# EAGLE design Wifi Board (EAGLE 9.4.2)
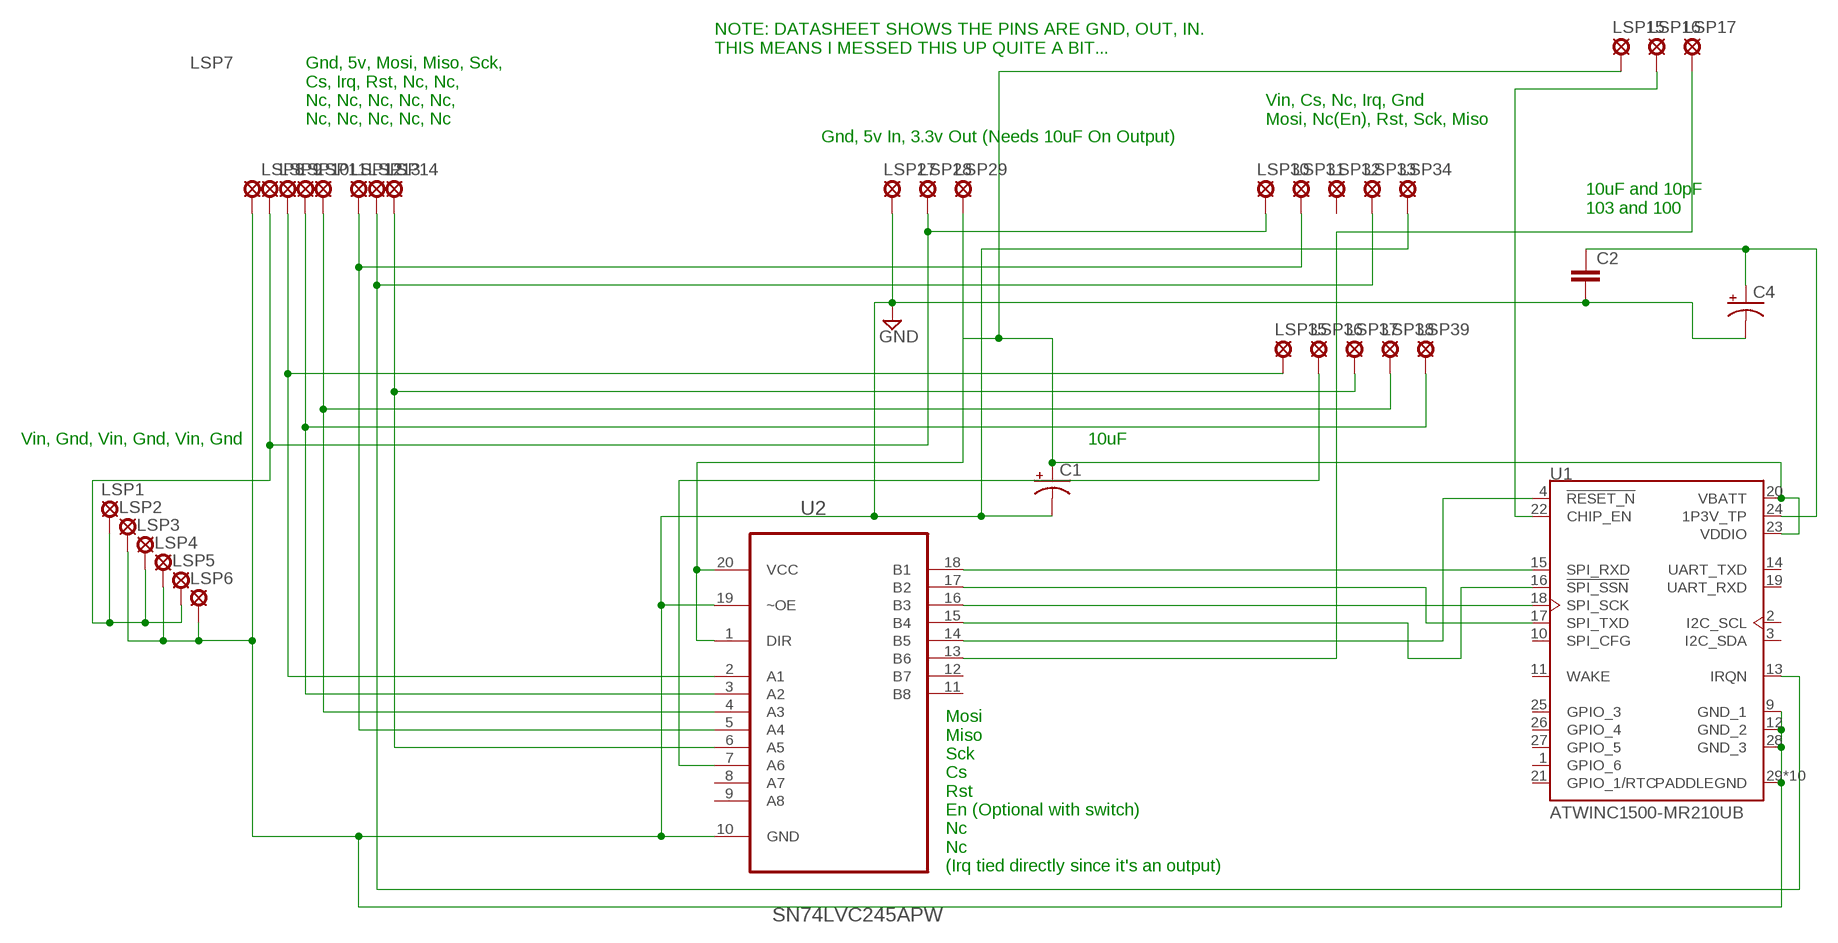
[diagram p0: schematic, sheet 1]

## Parts
C1  CPOL-USE2-4  [E2-4]
C2  C5/2.5  [C5B2.5]
C4  CPOL-USE2-4  [E2-4]
LSP1  LSP10_CLSP10_C  [LSP10_C]
LSP2  LSP10_CLSP10_C  [LSP10_C]
LSP3  LSP10_CLSP10_C  [LSP10_C]
LSP4  LSP10_CLSP10_C  [LSP10_C]
LSP5  LSP10_CLSP10_C  [LSP10_C]
LSP6  LSP10_CLSP10_C  [LSP10_C]
LSP7  LSP10_CLSP10_C  [LSP10_C]
LSP8  LSP10_CLSP10_C  [LSP10_C]
LSP9  LSP10_CLSP10_C  [LSP10_C]
LSP10  LSP10_CLSP10_C  [LSP10_C]
LSP11  LSP10_CLSP10_C  [LSP10_C]
LSP12  LSP10_CLSP10_C  [LSP10_C]
LSP13  LSP10_CLSP10_C  [LSP10_C]
LSP14  LSP10_CLSP10_C  [LSP10_C]
LSP15  LSP10_CLSP10_C  [LSP10_C]
LSP16  LSP10_CLSP10_C  [LSP10_C]
LSP17  LSP10_CLSP10_C  [LSP10_C]
LSP27  LSP10_CLSP10_C  [LSP10_C]
LSP28  LSP10_CLSP10_C  [LSP10_C]
LSP29  LSP10_CLSP10_C  [LSP10_C]
LSP30  LSP10_CLSP10_C  [LSP10_C]
LSP31  LSP10_CLSP10_C  [LSP10_C]
LSP32  LSP10_CLSP10_C  [LSP10_C]
LSP33  LSP10_CLSP10_C  [LSP10_C]
LSP34  LSP10_CLSP10_C  [LSP10_C]
LSP35  LSP10_CLSP10_C  [LSP10_C]
LSP36  LSP10_CLSP10_C  [LSP10_C]
LSP37  LSP10_CLSP10_C  [LSP10_C]
LSP38  LSP10_CLSP10_C  [LSP10_C]
LSP39  LSP10_CLSP10_C  [LSP10_C]
U1  ATWINC1500-MR210UB  [MICROCHIP_ATWINC1500-MR210UB]
U2  SN74LVC245APW  [SOP65P640X120-20N]

## Nets
GND: C1.- C2.2 C4.- LSP2.P$1(MP) LSP4.P$1(MP) LSP6.P$1(MP) LSP7.P$1(MP) LSP27.P$1(MP) LSP34.P$1(MP) U1.9(GND_1) U1.12(GND_2) U1.28(GND_3) U1.29(PADDLEGND) U1.P$1(PADDLEGND) U1.P$2(PADDLEGND) U1.P$3(PADDLEGND) U1.P$4(PADDLEGND) U1.P$5(PADDLEGND) U1.P$6(PADDLEGND) U1.P$7(PADDLEGND) U1.P$8(PADDLEGND) U1.P$9(PADDLEGND) U2.10(GND) U2.19(~OE)
N$1: LSP36.P$1(MP) U2.7(A6)
N$2: LSP1.P$1(MP) LSP3.P$1(MP) LSP5.P$1(MP) LSP8.P$1(MP) LSP28.P$1(MP) LSP30.P$1(MP)
N$4: C1.+ LSP15.P$1(MP) LSP29.P$1(MP) U1.20(VBATT) U1.23(VDDIO) U2.1(DIR) U2.20(VCC)
N$5: LSP9.P$1(MP) LSP35.P$1(MP) U2.2(A1)
N$6: LSP10.P$1(MP) LSP39.P$1(MP) U2.3(A2)
N$7: LSP11.P$1(MP) LSP38.P$1(MP) U2.4(A3)
N$8: LSP12.P$1(MP) LSP31.P$1(MP) U2.5(A4)
N$9: LSP13.P$1(MP) LSP33.P$1(MP) U1.13(IRQN)
N$10: LSP14.P$1(MP) LSP37.P$1(MP) U2.6(A5)
N$11: U1.15(SPI_RXD) U2.18(B1)
N$12: U1.17(SPI_TXD) U2.17(B2)
N$13: U1.18(SPI_SCK) U2.16(B3)
N$14: U1.16(!SPI_SSN) U2.15(B4)
N$15: LSP17.P$1(MP) U2.13(B6)
N$16: U1.4(!RESET_N) U2.14(B5)
N$17: LSP16.P$1(MP) U1.22(CHIP_EN)
N$20: C2.1 C4.+ U1.24(1P3V_TP)
Unconnected: LSP32.P$1(MP) U1.1(GPIO_6) U1.2(I2C_SCL) U1.3(I2C_SDA) U1.10(SPI_CFG) U1.11(WAKE) U1.14(UART_TXD) U1.19(UART_RXD) U1.21(GPIO_1/RTC) U1.25(GPIO_3) U1.26(GPIO_4) U1.27(GPIO_5) U2.8(A7) U2.9(A8) U2.11(B8) U2.12(B7)

## Notes on the sheet
- NOTE: DATASHEET SHOWS THE PINS ARE GND, OUT, IN.
  THIS MEANS I MESSED THIS UP QUITE A BIT...
- Gnd, 5v, Mosi, Miso, Sck,
  Cs, Irq, Rst, Nc, Nc,
  Nc, Nc, Nc, Nc, Nc,
  Nc, Nc, Nc, Nc, Nc
- Vin, Cs, Nc, Irq, Gnd
  Mosi, Nc(En), Rst, Sck, Miso
- Gnd, 5v In, 3.3v Out (Needs 10uF On Output)
- 10uF and 10pF
  103 and 100
- Vin, Gnd, Vin, Gnd, Vin, Gnd | 10uF
- Mosi
  Miso
  Sck
  Cs
  Rst
  En (Optional with switch)
  Nc
  Nc
  (Irq tied directly since it's an output)

## Library data of the parts
C1 C4 = rcl:CPOL-US: POLARIZED CAPACITOR, American symbol; SPICEPREFIX: C
C2 = capacitor-wima:C: CAPACITOR naming: grid - package width
LSP1-LSP17 LSP27-LSP39 = tbtaco-solpad:LSP10_C: SOLDER PAD drill 1.0 mm, distributor Buerklin, 12H555
U1 = ATWINC1500-MR210UB:ATWINC1500-MR210UB: SmartConnect ATWINC1500B-MU-T Module - SmartConnect ATWINC1500B-MU-T Module/ MODULE (R3); AVAILABILITY: Unavailable; DESCRIPTION: SmartConnect ATWINC1500B-MU-T Module - SmartConnect ATWINC1500B-MU-T Module/ MODULE _R3_; MF: Microchip; MP: ATWINC1500-MR210UB; PACKAGE: Module Microchip; PRICE: None
U2 = SN74LVC245APW:SN74LVC245APW: OCTAL BUS TRANSCEIVER WITH 3-STATE OUTPUTS; AVAILABILITY: Unavailable; DESCRIPTION: Octal Bus Transceiver With 3-State Outputs 20-TSSOP -40 to 125; MF: Texas Instruments; MP: SN74LVC245APW; PACKAGE: TSSOP-20 Texas Instruments; PRICE: None

## Board
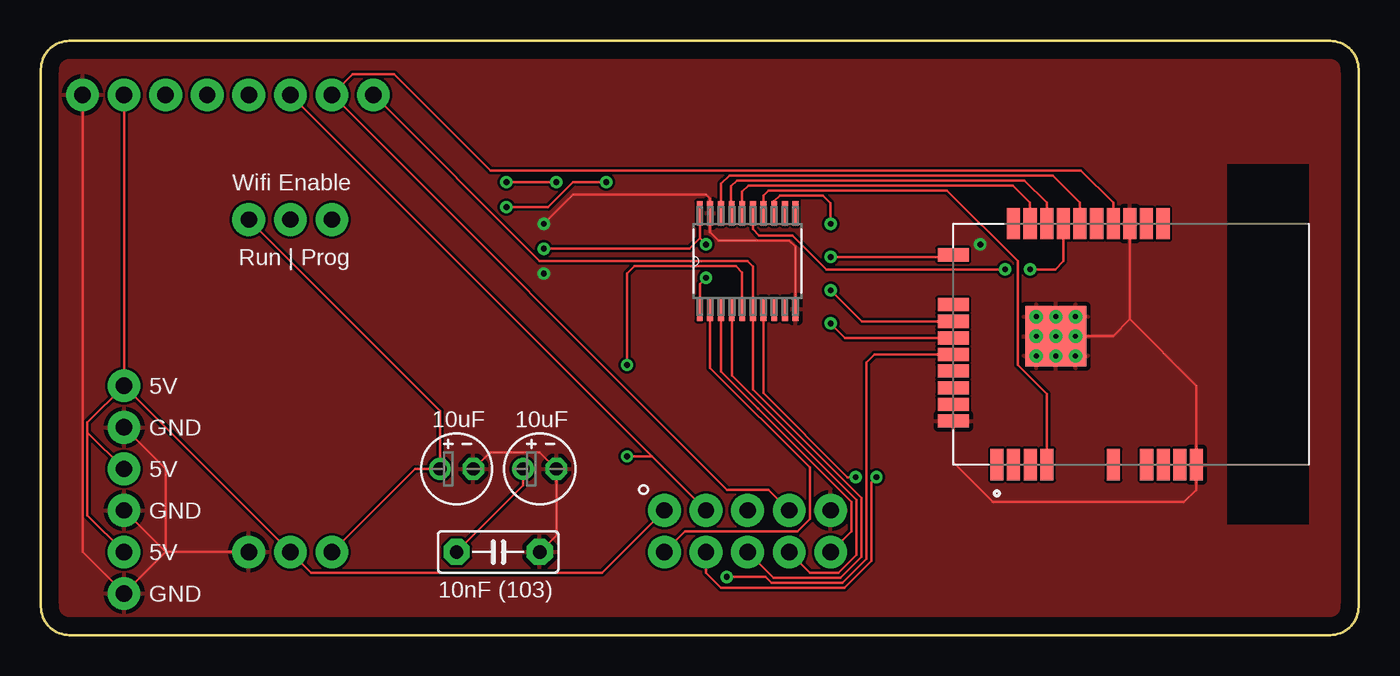
[diagram p1: board, top side]
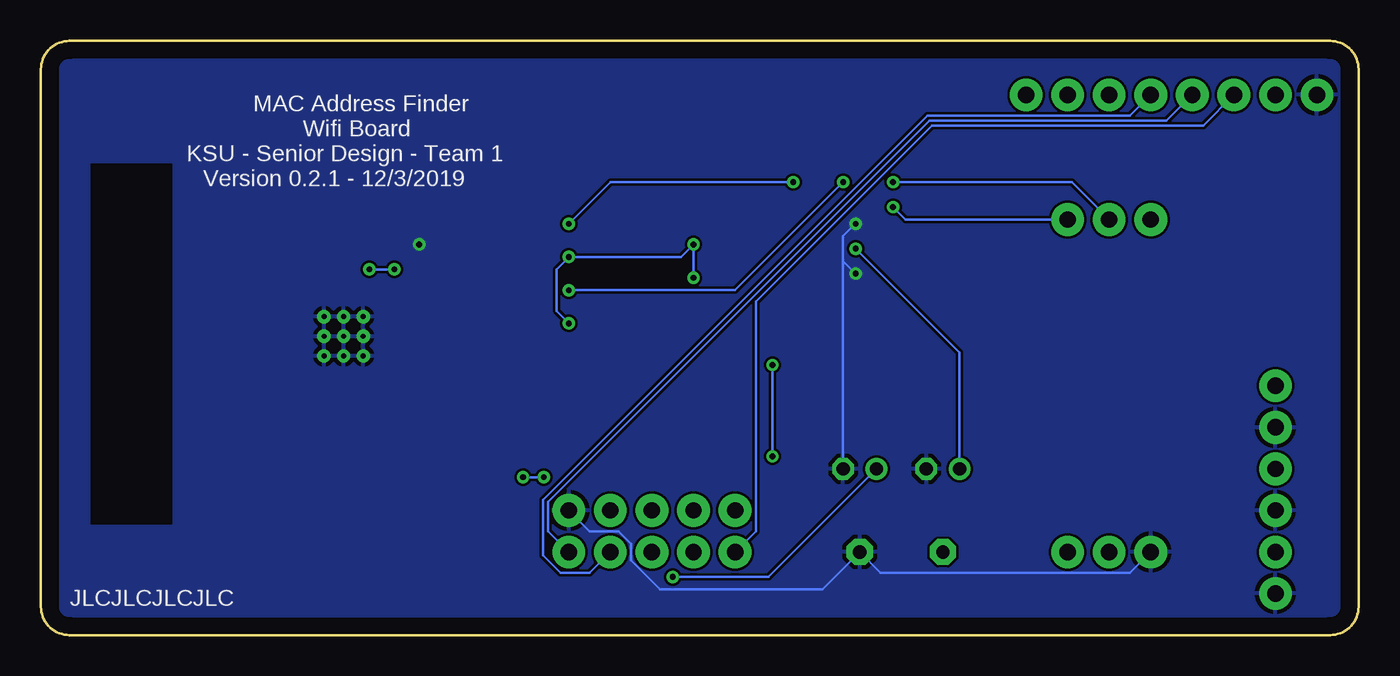
[diagram p2: board, bottom side, seen from below]

Size 80.52 x 36.32 mm. Coordinates in mm from the lower left corner, seen from the top.
Outline: 80.52,34.59 80.52,1.73 arc-90 78.78,0 1.73,0 arc-90 0,1.73 0,34.59 arc-90 1.73,36.32 78.78,36.32 arc-90 80.52,34.59
Copper layers (1*16): Top 0.035mm / dielectric 1.5mm / Bottom 0.035mm
Design rules "default": minimum track width 6mil, minimum drill 0.35mm, track to track 6mil, track to pad 6mil, pad to pad 6mil, via to via 6mil, smd to smd 6mil, copper to edge 40mil, drill to drill 6mil, minimum pad ring 10mil, minimum via ring 8mil, stop-mask expansion 4mil, vias tented up to drill 0mil, thermal gap 10mil

### Footprints (pad centres in the part's own frame; a part is rotated, then mirrored left to right if it is on the bottom)
E2-4 = drill 0.813 pad 1.27: + -1.016,0 | drill 0.813 pad 1.27 octagon: - 1.016,0
C5B2.5 = drill 0.813 pad 1.6 octagon: 1 -2.54,0; 2 2.54,0
LSP10_C = drill 1 pad 2: P$1 0,0
MICROCHIP_ATWINC1500-MR210UB = smd 1.9 x 0.8: 1 7.365,0; 2 7.365,1.016; 3 7.365,2.032; 4 7.365,3.048; 5 7.365,7.112; 6 7.365,9.144; 7 7.365,10.16; 8 7.365,11.176; 9 7.365,12.192; 10 -7.365,10.154; 11 -7.365,9.138; 12 -7.365,8.122; 13 -7.365,7.106; 14 -7.365,6.09; 15 -7.365,5.074; 16 -7.365,4.058; 17 -7.365,3.042; 18 -7.365,2.026; 19 -7.365,1.01 | smd 0.8 x 1.9: 20 -5.465,-2.67; 21 -2.417,-2.67; 22 -1.401,-2.67; 23 -0.385,-2.67; 24 0.631,-2.67; 25 1.647,-2.67; 26 2.663,-2.67; 27 3.679,-2.67; 28 4.695,-2.67 | smd 3.7 x 3.7: 29 -0.485,3.6 | drill 0.3 pad 0.5: P$1 -0.485,3.6; P$2 -1.685,3.6; P$3 0.715,3.6; P$4 -1.685,4.8; P$5 -0.485,4.8; P$6 0.715,4.8; P$7 -1.685,2.4; P$8 -0.485,2.4; P$9 0.715,2.4
SOP65P640X120-20N = smd 1.473 x 0.356: 1 -2.921,2.921; 2 -2.921,2.286; 3 -2.921,1.626; 4 -2.921,0.965; 5 -2.921,0.33; 6 -2.921,-0.33; 7 -2.921,-0.965; 8 -2.921,-1.626; 9 -2.921,-2.286; 10 -2.921,-2.921; 11 2.921,-2.921; 12 2.921,-2.286; 13 2.921,-1.626; 14 2.921,-0.965; 15 2.921,-0.33; 16 2.921,0.33; 17 2.921,0.965; 18 2.921,1.626; 19 2.921,2.286; 20 2.921,2.921

### Placement (x,y rotation side)
C1  25.4,10.16 0 top
C2  27.94,5.08 0 top
C4  30.48,10.16 0 top
LSP1  5.08,15.24 0 top
LSP2  5.08,12.7 0 top
LSP3  5.08,10.16 0 top
LSP4  5.08,7.62 0 top
LSP5  5.08,5.08 0 top
LSP6  5.08,2.54 0 top
LSP7  2.54,33.02 0 top
LSP8  5.08,33.02 0 top
LSP9  7.62,33.02 0 top
LSP10  10.16,33.02 0 top
LSP11  12.7,33.02 0 top
LSP12  15.24,33.02 0 top
LSP13  17.78,33.02 0 top
LSP14  20.32,33.02 0 top
LSP15  12.7,25.4 0 top
LSP16  15.24,25.4 0 top
LSP17  17.78,25.4 0 top
LSP27  12.7,5.08 0 top
LSP28  15.24,5.08 0 top
LSP29  17.78,5.08 0 top
LSP30  38.1,7.62 0 top
LSP31  40.64,7.62 0 top
LSP32  43.18,7.62 0 top
LSP33  45.72,7.62 0 top
LSP34  48.26,7.62 0 top
LSP35  38.1,5.08 0 top
LSP36  40.64,5.08 0 top
LSP37  43.18,5.08 0 top
LSP38  45.72,5.08 0 top
LSP39  48.26,5.08 0 top
U1  58.42,17.78 270 top
U2  43.18,22.86 90 top

### Tracks (layer width: path | path; a pad name or v marks a point on that pad's centre or on a via)
GND  (via drill 0.35)
  Top 0.152: 7.62,5.08 LSP6.P$1 2.54,5.08 LSP7.P$1 | 7.62,5.08 LSP27.P$1 | LSP4.P$1 7.62,5.08 | LSP2.P$1 7.62,10.16 7.62,5.08 | U2.10 46.1,23.75 45.72,24.13 41.4,24.13 40.89,24.64 U2.19 40.89,26.67 40.64,26.92 32.51,26.92 v30.73,25.15 | C2.2 31.5,6.1 C4.- 30.48,11.18 27.43,11.18 C1.- | U1.12 66.54,19.31 | 66.54,19.31 70.61,15.24 U1.9 70.61,8.89 69.85,8.13 58.17,8.13 55.75,10.54 U1.28 | 66.54,19.31 65.52,18.29 64.52,18.29 63.25,18.29 U1.P$5 U1.29 | U1.29 U1.P$2 | U1.29 U1.P$7 | U1.29 U1.P$8 | U1.29 U1.P$9 | U1.29 U1.P$3 | U1.29 U1.P$6 | U1.29 U1.P$4
  Bottom 0.152: LSP27.P$1 13.97,3.81 29.21,3.81 C2.2 32.77,2.79 42.67,2.79 44.45,4.57 44.45,5.59 45.21,6.35 46.99,6.35 LSP34.P$1 | v30.73,25.15 31.5,24.38 31.5,22.86 | v30.73,22.1 31.5,22.86 | 31.5,22.86 C4.-
  other vias: 57.4,23.88
  pour Top: 0,0 0,36.32 3.56,36.32 80.52,36.32 80.52,0 77.72,0
  pour Bottom: 0,0 0,36.32 80.52,36.32 80.52,0
N$1  (via drill 0.35)
  Top 0.152: v49.78,9.65 49.3,9.65 44.15,14.81 U2.7 | LSP36.P$1 40.64,3.81 41.55,2.9 49.11,2.9 50.75,4.54 50.75,9.35 v51.05,9.65
  Bottom 0.152: v49.78,9.65 v51.05,9.65
N$2
  Top 0.152: LSP8.P$1 LSP1.P$1 | LSP5.P$1 2.84,7.31 2.84,12.4 | LSP1.P$1 2.84,13.01 2.84,12.4 | LSP3.P$1 2.84,12.4 | LSP1.P$1 LSP28.P$1 16.51,3.81 34.29,3.81 LSP30.P$1
N$4  (via drill 0.35)
  Top 0.152: LSP29.P$1 22.86,10.16 C1.+ 24.38,13.72 LSP15.P$1 | U2.20 40.26,24.26 | 40.26,24.26 v40.64,23.88 | U2.1 40.26,21.46 v40.64,21.84 | U1.20 55.62,23.11 v48.26,23.11 | 40.26,24.26 39.62,23.62 v30.73,23.62 | U1.23 49.15,18.16 v48.26,19.05
  Bottom 0.152: v40.64,21.84 v40.64,23.88 41.4,23.11 v48.26,23.11 49.02,22.35 49.02,19.81 v48.26,19.05 | C1.+ 24.38,17.27 v30.73,23.62
N$5
  Top 0.152: LSP35.P$1 39.37,6.35 46.23,6.35 46.99,7.11 46.99,10.24 40.89,16.33 U2.2
  Bottom 0.152: LSP9.P$1 9.5,31.14 26.09,31.14 36.83,20.4 36.83,6.35 LSP35.P$1
N$6
  Top 0.152: LSP39.P$1 49.53,6.35 49.53,8.13 43.82,13.84 41.55,16.1 U2.3
  Bottom 0.152: LSP39.P$1 49.53,6.35 49.53,8.13 26.21,31.45 11.74,31.45 LSP10.P$1
N$7
  Top 0.152: U2.4 42.22,15.87 49.84,8.25 49.84,4.92 48.73,3.81 46.99,3.81 LSP38.P$1
  Bottom 0.152: LSP38.P$1 46.99,3.81 48.77,3.81 49.84,4.88 49.84,8.25 26.34,31.75 13.97,31.75 LSP11.P$1
N$8  (via drill 0.35)
  Top 0.152: LSP12.P$1 37.34,10.92 | 37.34,10.92 LSP31.P$1 | v35.81,10.92 37.34,10.92 | v35.81,16.51 35.81,22.1 36.27,22.55 42.47,22.55 42.85,22.17 U2.5
  Bottom 0.152: v35.81,16.51 v35.81,10.92
N$9
  Top 0.152: LSP33.P$1 44.45,8.89 41.91,8.89 LSP13.P$1 19.05,34.29 21.59,34.29 27.48,28.4 63.55,28.4 65.53,26.42 U1.13
N$10
  Top 0.152: LSP14.P$1 30.48,22.86 43.18,22.86 43.51,22.53 43.51,20.07 U2.6 43.51,15.01 50.14,8.38 50.14,4.79 48.85,3.51 44.76,3.51 LSP37.P$1
N$11
  Top 0.152: U1.15 63.49,26.42 61.82,28.09 42.06,28.09 41.55,27.58 U2.18
N$12
  Top 0.152: U1.17 61.46,26.42 60.1,27.79 42.52,27.79 42.16,27.43 42.16,25.83 U2.17
N$13
  Top 0.152: U1.18 60.45,26.42 59.39,27.48 43.23,27.48 42.85,27.1 U2.16
N$14  (via drill 0.35)
  Top 0.152: U2.15 43.51,24.82 43.89,24.44 45.92,24.44 48.01,22.35 v58.93,22.35 | v60.45,22.35 61.98,22.35 62.48,22.85 U1.16
  Bottom 0.152: v58.93,22.35 v60.45,22.35
N$15  (via drill 0.35)
  Top 0.152: v48.26,25.15 48.26,26.42 47.8,26.87 45.16,26.87 44.81,26.52 U2.13 | v34.54,27.69 32.51,27.69 30.99,26.16 v28.45,26.16
  Bottom 0.152: v28.45,26.16 27.69,25.4 LSP17.P$1 | v34.54,27.69 45.72,27.69 v48.26,25.15
N$16
  Top 0.152: U1.4 61.47,14.73 59.69,16.51 59.69,22.86 55.37,27.18 44.45,27.18 44.15,26.87 U2.14
N$17  (via drill 0.35)
  Top 0.152: v28.45,27.69 v31.5,27.69 | U1.22 50.16,19.18 v48.26,21.08
  Bottom 0.152: v31.5,27.69 38.1,21.08 v48.26,21.08 | LSP16.P$1 17.53,27.69 v28.45,27.69
N$20  (via drill 0.35)
  Top 0.152: U1.24 50.93,17.15 50.44,16.66 50.44,4.66 48.98,3.2 44.63,3.2 44.27,3.56 v41.91,3.56 | C2.1 29.46,9.14 C4.+
  Bottom 0.152: v41.91,3.56 38.35,3.56 37.85,3.56 36.07,3.56 C4.+

### Text on the board
tPlace: Wifi Enable | Run | Prog | 5V | 10uF | 10uF | GND | 5V | GND | 5V | GND | 10nF (103)
bPlace: MAC Address Finder | Wifi Board | KSU - Senior Design - Team 1 | Version 0.2.1 - 12/3/2019 | JLCJLCJLCJLC